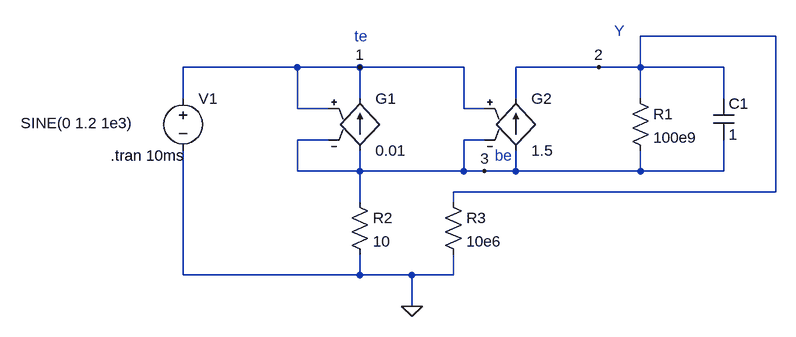
[diagram p0: schematic modelo_memristor_simulacion.asc]
modelo_memristor_simulacion.asc, the LTspice schematic file:
Version 4
SHEET 1 880 680
WIRE 864 -16 656 -16
WIRE 128 32 -48 32
WIRE 224 32 128 32
WIRE 384 32 224 32
WIRE 592 32 464 32
WIRE 656 32 656 -16
WIRE 656 32 592 32
WIRE 784 32 656 32
WIRE -48 80 -48 32
WIRE 224 80 224 32
WIRE 464 80 464 32
WIRE 656 80 656 32
WIRE 784 80 784 32
WIRE 128 96 128 32
WIRE 176 96 128 96
WIRE 384 96 384 32
WIRE 416 96 384 96
WIRE 176 144 128 144
WIRE 416 144 384 144
WIRE 128 192 128 144
WIRE 224 192 224 160
WIRE 224 192 128 192
WIRE 384 192 384 144
WIRE 384 192 224 192
WIRE 416 192 384 192
WIRE 464 192 464 160
WIRE 464 192 416 192
WIRE 656 192 656 160
WIRE 656 192 464 192
WIRE 784 192 784 144
WIRE 784 192 656 192
WIRE 864 224 864 -16
WIRE 864 224 368 224
WIRE 224 240 224 192
WIRE 368 240 368 224
WIRE -48 352 -48 160
WIRE 224 352 224 320
WIRE 224 352 -48 352
WIRE 304 352 224 352
WIRE 368 352 368 320
WIRE 368 352 304 352
WIRE 304 400 304 352
FLAG 304 400 0
FLAG 224 32 1
FLAG 592 32 2
FLAG 416 192 3
SYMBOL voltage -48 64 R0
WINDOW 3 -250 54 Left 2
WINDOW 123 0 0 Left 0
WINDOW 39 0 0 Left 0
SYMATTR Value SINE(0 1.2 1e3)
SYMATTR InstName V1
SYMBOL g 224 64 R0
SYMATTR InstName G1
SYMATTR Value 0.01
SYMBOL g 464 64 R0
SYMATTR InstName G2
SYMATTR Value 1.5
SYMBOL res 640 64 R0
SYMATTR InstName R1
SYMATTR Value 100e9
SYMBOL res 208 224 R0
SYMATTR InstName R2
SYMATTR Value 10
SYMBOL res 352 224 R0
SYMATTR InstName R3
SYMATTR Value 10e6
SYMBOL cap 768 80 R0
SYMATTR InstName C1
SYMATTR Value 1
TEXT -160 168 Left 2 !.tran 10ms
TEXT 216 -16 Left 2 ;te
TEXT 616 -24 Left 2 ;Y
TEXT 432 168 Left 2 ;be

The netlist it stands for:
* modelo_memristor_simulacion.asc
V1 1 0 SINE(0 1.2 1e3)
G1 3 1 1 3 0.01
G2 3 2 1 3 1.5
R1 2 3 100e9
R2 3 0 10
R3 2 0 10e6
C1 2 3 1
.tran 10ms
* te
* Y
* be
.backanno
.end

* Results of the author's LTspice run, read from the files saved beside the schematic
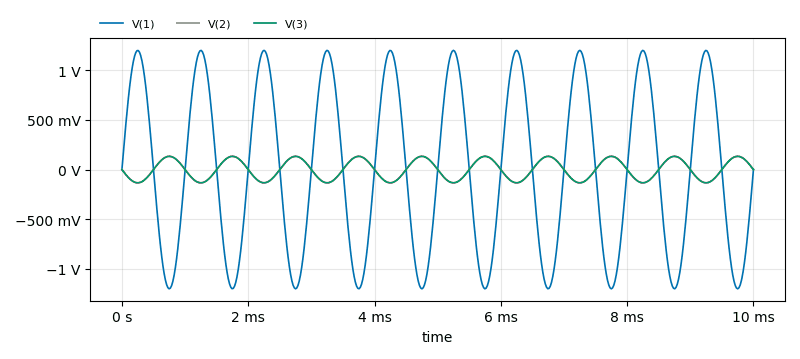
[diagram p1: Transient Analysis of modelo_memristor_simulacion.asc, plotted from the saved traces]
* Transient Analysis, 1 run:
*   V(1): min -1.2 V, max 1.2 V, average -805.4 nV, rms 848.6 mV, last 0 V
*   V(2): min -132.9 mV, max 133.5 mV, average 318.3 µV, rms 94.2 mV, last 0 V
*   V(3): min -133.2 mV, max 133.2 mV, average 86.09 nV, rms 94.2 mV, last 0 V